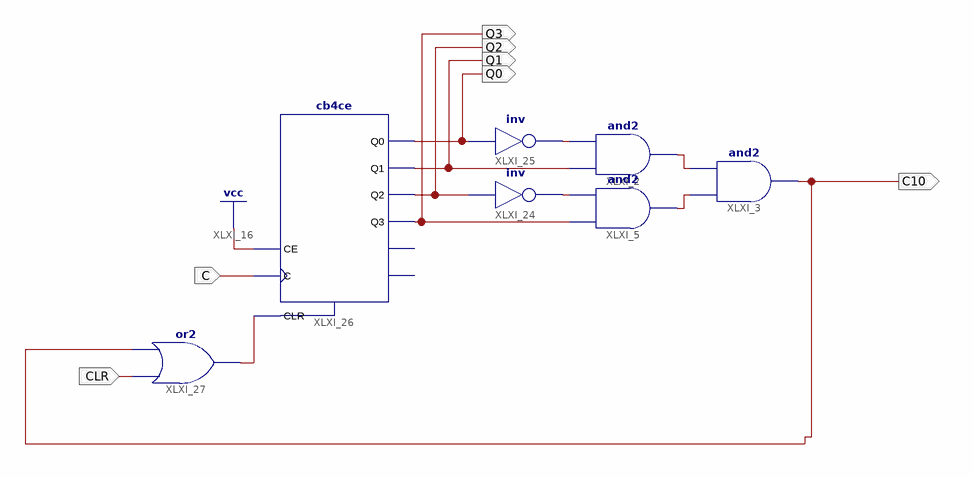
[diagram p0: schematic sheet 1]
// Xilinx ISE schematic conta10.sch (spartan3e) as structural Verilog: 7 symbols, 7 ports
module conta10 (
  input  C,
  input  CLR,
  output Q1,
  output Q0,
  output Q2,
  output Q3,
  output C10
);

  wire XLXN_3, XLXN_4, XLXN_42, XLXN_43, XLXN_48;

  and XLXI_3 (C10, XLXN_4, XLXN_3);
  and XLXI_2 (XLXN_3, Q1, XLXN_43);
  and XLXI_5 (XLXN_4, Q3, XLXN_42);
  not XLXI_24 (XLXN_42, Q2);
  not XLXI_25 (XLXN_43, Q0);
  cb4ce XLXI_26 (.C(C), .CE(1'b1), .CLR(XLXN_48), .Q0(Q0), .Q1(Q1), .Q2(Q2), .Q3(Q3));  // open: CEO, TC
  or XLXI_27 (XLXN_48, CLR, C10);
endmodule
